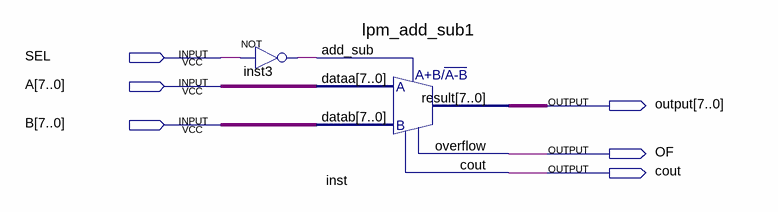
[diagram p0: schematic sheet]
// Quartus schematic test_add_sub.bdf as structural Verilog: 2 symbols, 6 pins
module test_add_sub (
  input  SEL,
  input  [7:0] A,
  input  [7:0] B,
  output [7:0] \output ,
  output OF,
  output cout
);

  wire inst3_out;

  not inst3 (inst3_out, SEL);
  lpm_add_sub1 inst (.dataa(A), .datab(B), .add_sub(inst3_out), .result(\output ), .overflow(OF), .cout(cout));
endmodule
